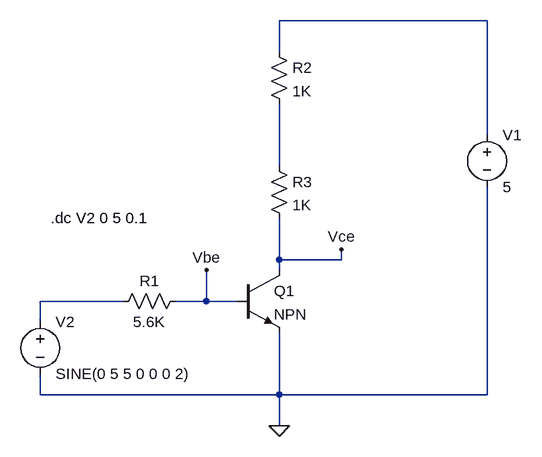
[diagram p0: schematic Draft1.asc]
Draft1.asc, the LTspice schematic file:
Version 4
SHEET 1 880 680
WIRE 640 -144 320 -144
WIRE 320 -96 320 -144
WIRE 640 32 640 -144
WIRE 320 80 320 -16
WIRE 320 224 320 160
WIRE 416 224 416 208
WIRE 416 224 320 224
WIRE 320 240 320 224
WIRE 80 288 -48 288
WIRE 208 288 208 240
WIRE 208 288 160 288
WIRE 256 288 208 288
WIRE -48 320 -48 288
WIRE -48 432 -48 400
WIRE 320 432 320 336
WIRE 320 432 -48 432
WIRE 640 432 640 112
WIRE 640 432 320 432
WIRE 320 480 320 432
FLAG 320 480 0
FLAG 208 240 Vbe
FLAG 416 208 Vce
SYMBOL res 176 272 R90
WINDOW 0 0 56 VBottom 2
WINDOW 3 32 56 VTop 2
SYMATTR InstName R1
SYMATTR Value 5.6K
SYMBOL res 304 -112 R0
SYMATTR InstName R2
SYMATTR Value 1K
SYMBOL res 304 64 R0
SYMATTR InstName R3
SYMATTR Value 1K
SYMBOL npn 256 240 R0
SYMATTR InstName Q1
SYMBOL voltage 640 16 R0
SYMATTR InstName V1
SYMATTR Value 5
SYMBOL voltage -48 304 R0
SYMATTR InstName V2
SYMATTR Value SINE(0 5 5 0 0 0 2)
TEXT -32 160 Left 2 !.dc V2 0 5 0.1

The netlist it stands for:
* Draft1.asc
R1 Vbe N003 5.6K
R2 N001 N002 1K
R3 N002 Vce 1K
Q1 Vce Vbe 0 0 NPN
V1 N001 0 5
V2 N003 0 SINE(0 5 5 0 0 0 2)
.model NPN NPN
.model PNP PNP
.lib standard.bjt
.dc V2 0 5 0.1
.backanno
.end

* Results of the author's LTspice run, read from the files saved beside the schematic
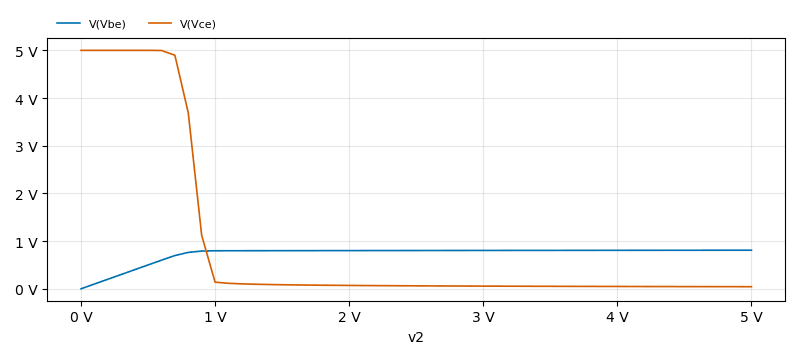
[diagram p1: DC transfer characteristic of Draft1.asc, plotted from the saved traces]
* DC transfer characteristic, 1 run:
*   V(Vbe): 28 nV at v2=0 V, 809.4 mV at v2=5 V, min 28 nV, max 809.4 mV
*   V(Vce): 5 V at v2=0 V, 44.06 mV at v2=5 V, min 44.06 mV, max 5 V